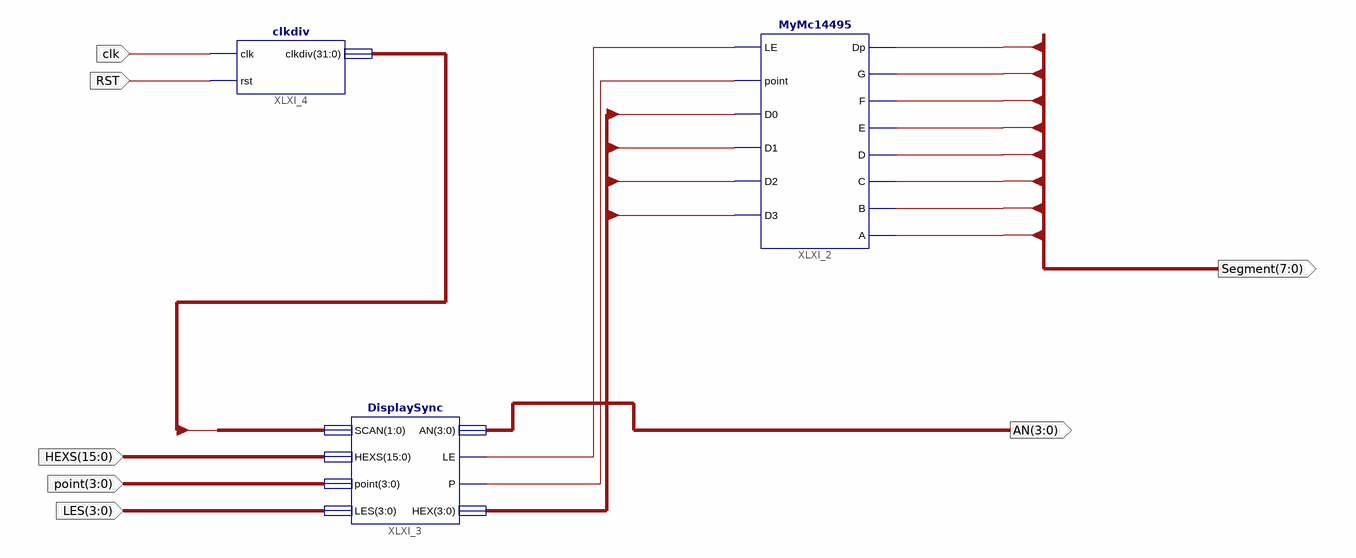
[diagram p0: schematic sheet 1]
// Xilinx ISE schematic disp_num.sch (kintex7) as structural Verilog: 3 symbols, 7 ports
module disp_num (
  input  clk,
  input  RST,
  input  [15:0] HEXS,
  input  [3:0] point,
  input  [3:0] LES,
  output [3:0] AN,
  output [7:0] Segment
);

  wire XLXN_13, XLXN_14;
  wire [3:0] HEX;
  wire [31:0] clkd;

  MyMc14495 XLXI_2 (
    .LE(XLXN_14), .point(XLXN_13), .D0(HEX[0]), .D1(HEX[1]), .D2(HEX[2]), .D3(HEX[3]), .Dp(Segment[7]),
    .G(Segment[6]), .F(Segment[5]), .E(Segment[4]), .D(Segment[3]), .C(Segment[2]), .B(Segment[1]),
    .A(Segment[0]));
  DisplaySync XLXI_3 (
    .SCAN(clkd[18:17]), .HEXS(HEXS), .point(point), .LES(LES), .AN(AN), .LE(XLXN_14), .P(XLXN_13), .HEX(HEX));
  clkdiv XLXI_4 (.clk(clk), .rst(RST), .clkdiv(clkd));
endmodule
